# EAGLE design WS2801_MOSFET_Demo (EAGLE 6.5.0)
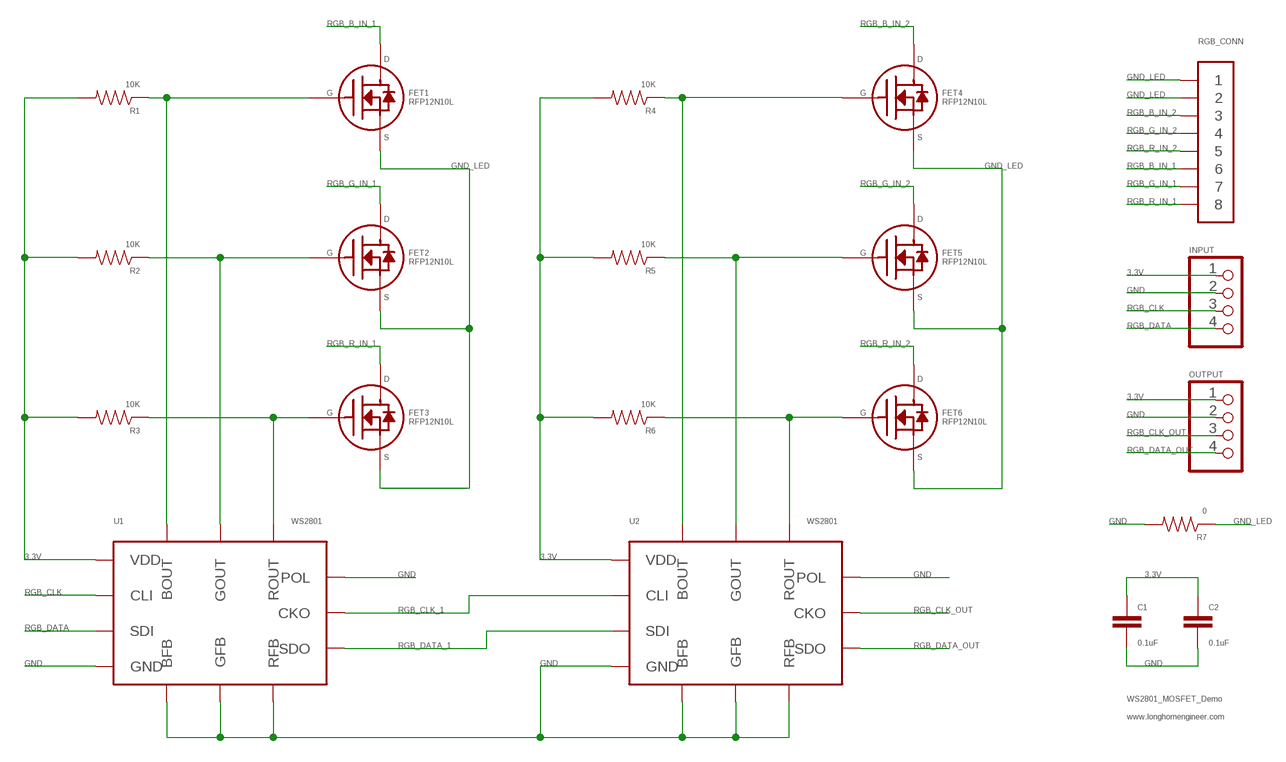
[diagram p0: schematic, sheet 1]

## Parts
C1  0.1uF  CAPACITOR_NON_POLAR0402  [0402]
C2  0.1uF  CAPACITOR_NON_POLAR0402  [0402]
FET1  RFP12N10L  MOSFET_N-CHANNEL_SINGLETO-220AB  [TO-220AB]
FET2  RFP12N10L  MOSFET_N-CHANNEL_SINGLETO-220AB  [TO-220AB]
FET3  RFP12N10L  MOSFET_N-CHANNEL_SINGLETO-220AB  [TO-220AB]
FET4  RFP12N10L  MOSFET_N-CHANNEL_SINGLETO-220AB  [TO-220AB]
FET5  RFP12N10L  MOSFET_N-CHANNEL_SINGLETO-220AB  [TO-220AB]
FET6  RFP12N10L  MOSFET_N-CHANNEL_SINGLETO-220AB  [TO-220AB]
INPUT  PH_1X04HEADER_PTH_ROUND  [HEADER_01X04_PTH_ROUND]
OUTPUT  PH_1X04HEADER_PTH_ROUND  [HEADER_01X04_PTH_ROUND]
R1  10K  RESISTOR0805  [0805]
R2  10K  RESISTOR0805  [0805]
R3  10K  RESISTOR0805  [0805]
R4  10K  RESISTOR0805  [0805]
R5  10K  RESISTOR0805  [0805]
R6  10K  RESISTOR0805  [0805]
R7  0  RESISTOR0402  [0402]
RGB_CONN  26-60-4080  PH_1X08PTH_ROUND  [HEADER_01X08_PTH_ROUND]
U1  WS2801  WS2801SOP-14  [SOP-14]
U2  WS2801  WS2801SOP-14  [SOP-14]

## Nets
3.3V: C1.1 C2.1 INPUT.1 OUTPUT.1 R1.2 R2.2 R3.2 R4.2 R5.2 R6.2 U1.14(VDD) U2.14(VDD)
GATE_B_IN_1: FET1.G(GATE) R1.1 U1.8(BOUT)
GATE_B_IN_2: FET4.G(GATE) R4.1 U2.8(BOUT)
GATE_G_IN_1: FET2.G(GATE) R2.1 U1.9(GOUT)
GATE_G_IN_2: FET5.G(GATE) R5.1 U2.9(GOUT)
GATE_R_IN_1: FET3.G(GATE) R3.1 U1.10(ROUT)
GATE_R_IN_2: FET6.G(GATE) R6.1 U2.10(ROUT)
GND: C1.2 C2.2 INPUT.2 OUTPUT.2 R7.2 U1.3(POL) U1.4(RFB) U1.5(GFB) U1.6(BFB) U1.7(GND) U2.3(POL) U2.4(RFB) U2.5(GFB) U2.6(BFB) U2.7(GND)
GND_LED: FET1.S(SOURCE) FET2.S(SOURCE) FET3.S(SOURCE) FET4.S(SOURCE) FET5.S(SOURCE) FET6.S(SOURCE) R7.1 RGB_CONN.1 RGB_CONN.2
RGB_B_IN_1: FET1.D(DRAIN) RGB_CONN.6
RGB_B_IN_2: FET4.D(DRAIN) RGB_CONN.3
RGB_CLK: INPUT.3 U1.1(CLI)
RGB_CLK_1: U1.13(CKO) U2.1(CLI)
RGB_CLK_OUT: OUTPUT.3 U2.13(CKO)
RGB_DATA: INPUT.4 U1.2(SDI)
RGB_DATA_1: U1.12(SDO) U2.2(SDI)
RGB_DATA_OUT: OUTPUT.4 U2.12(SDO)
RGB_G_IN_1: FET2.D(DRAIN) RGB_CONN.7
RGB_G_IN_2: FET5.D(DRAIN) RGB_CONN.4
RGB_R_IN_1: FET3.D(DRAIN) RGB_CONN.8
RGB_R_IN_2: FET6.D(DRAIN) RGB_CONN.5

## Notes on the sheet
- WS2801_MOSFET_Demo
- www.longhornengineer.com

## Library data of the parts
C1 C2 = PP_Passives:CAPACITOR_NON_POLAR: Capacitor Non Polarized
FET1-FET6 = PP_DiscreteSemi:MOSFET_N-CHANNEL_SINGLE: Mosfet - N-Channel - Single
INPUT OUTPUT = PP_Connectors:PH_1X04: 4 Pin Connectors
R1-R7 = PP_Passives:RESISTOR: Resistors
RGB_CONN = PP_Connectors:PH_1X08
U1 U2 = PP_DigitalIC:WS2801

## Net classes
0 default: width 0.178 mm, drill 0.5 mm, clearance 0.178 mm

## Board
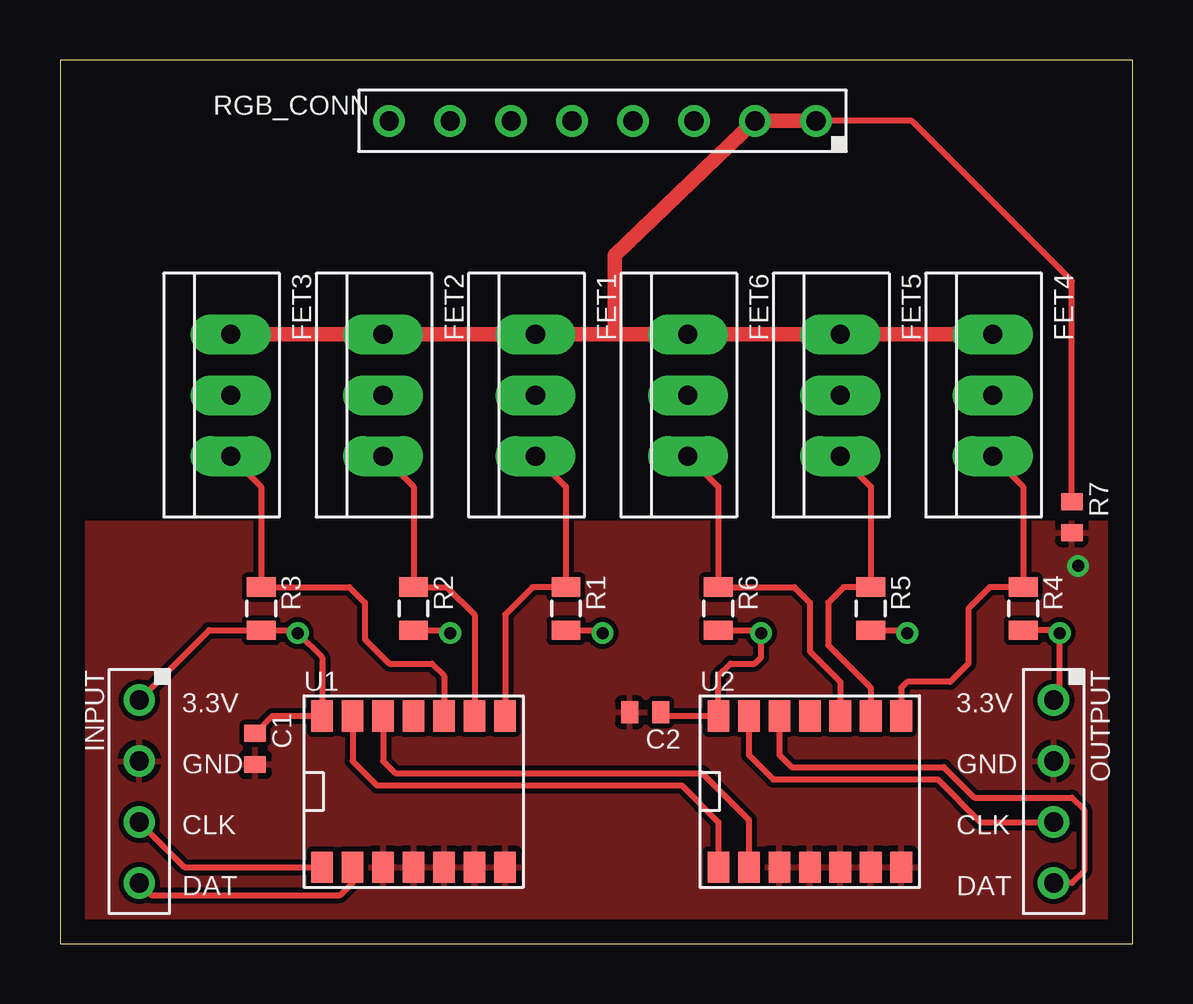
[diagram p1: board, top side]
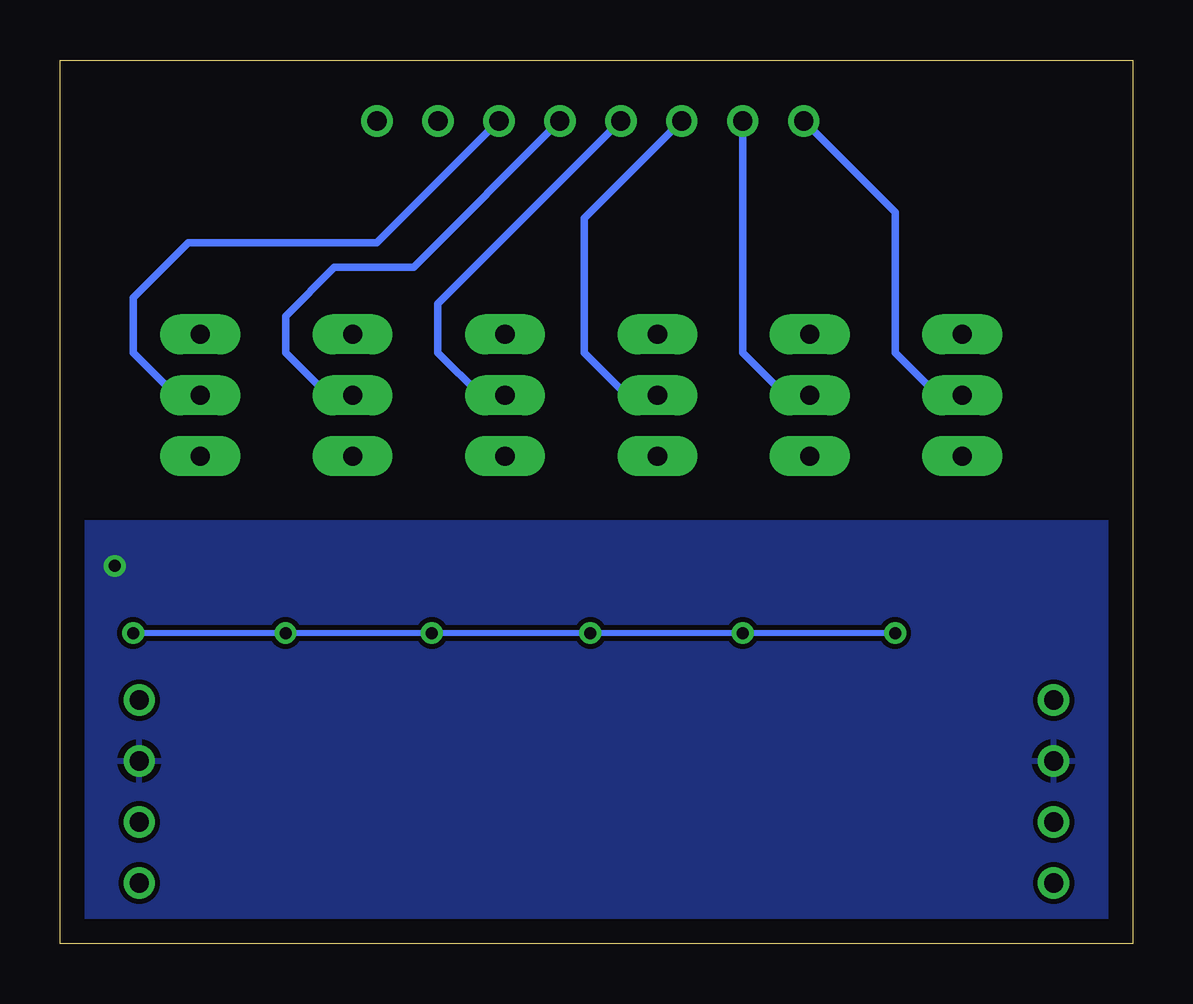
[diagram p2: board, bottom side, seen from below]

Size 44.7 x 36.83 mm. Coordinates in mm from the lower left corner, seen from the top.
Outline: 0,36.83 0,0 44.7,0 44.7,36.83 0,36.83
Copper layers (1*16): Top 0.035mm / dielectric 1.5mm / Bottom 0.035mm
Design rules "default": minimum track width 10mil, minimum drill 0.6mm, track to track 8mil, track to pad 8mil, pad to pad 8mil, via to via 8mil, smd to smd 8mil, copper to edge 40mil, drill to drill 8mil, minimum pad ring 10mil, minimum via ring 8mil, stop-mask expansion 4mil, vias tented up to drill 0mil, thermal gap 10mil

### Footprints (pad centres in the part's own frame; a part is rotated, then mirrored left to right if it is on the bottom)
0402 = smd 0.7 x 0.9: 1 -0.65,0; 2 0.65,0
TO-220AB = drill 0.8 pad 1.676 long: D 0,0; G 2.54,0; S -2.54,0
HEADER_01X04_PTH_ROUND = drill 0.8: 1 -3.81,0; 2 -1.27,0; 3 1.27,0; 4 3.81,0
0805 = smd 0.8 x 1.2: 1 -0.9,0; 2 0.9,0
HEADER_01X08_PTH_ROUND = drill 0.8: 1 -8.89,0; 2 -6.35,0; 3 -3.81,0; 4 -1.27,0; 5 1.27,0; 6 3.81,0; 7 6.35,0; 8 8.89,0
SOP-14 = smd 0.9 x 1.3: 1 -3.81,-3.15; 2 -2.54,-3.15; 3 -1.27,-3.15; 4 0,-3.15; 5 1.27,-3.15; 6 2.54,-3.15; 7 3.81,-3.15; 8 3.81,3.15; 9 2.54,3.15; 10 1.27,3.15; 11 0,3.15; 12 -1.27,3.15; 13 -2.54,3.15; 14 -3.81,3.15

### Placement (x,y rotation side)
C1  8.13,8.13 270 top
C2  24.38,9.65 180 top
FET1  19.81,22.86 270 top
FET2  13.46,22.86 270 top
FET3  7.11,22.86 270 top
FET4  38.86,22.86 270 top
FET5  32.51,22.86 270 top
FET6  26.16,22.86 270 top
INPUT  3.3,6.35 270 top
OUTPUT  41.4,6.35 270 top
R1  21.08,13.97 270 top
R2  14.73,13.97 270 top
R3  8.38,13.97 270 top
R4  40.13,13.97 270 top
R5  33.78,13.97 270 top
R6  27.43,13.97 270 top
R7  42.16,17.78 270 top
RGB_CONN  22.61,34.29 180 top
U1  14.73,6.35 0 top
U2  31.24,6.35 0 top

### Tracks (layer width: path | path; a pad name or v marks a point on that pad's centre or on a via)
3.3V  (via drill 0.5)
  Top 0.254: R4.2 41.54,13.07 v41.66,12.95 41.66,10.41 OUTPUT.1 | R5.2 35.19,13.07 v35.31,12.95 | R6.2 29.09,13.07 v29.21,12.95 29.21,11.94 28.96,11.68 27.94,11.68 27.43,11.18 U2.14 25.19,9.5 C2.1 | R1.2 22.49,13.07 v22.61,12.95 | R2.2 16.14,13.07 v16.26,12.95 | INPUT.1 6.21,13.07 R3.2 9.79,13.07 v9.91,12.95 10.92,11.94 U1.14 8.85,9.5 C1.1
  Bottom 0.254: v9.91,12.95 v16.26,12.95 v22.61,12.95 v29.21,12.95 v35.31,12.95 v41.66,12.95
GATE_B_IN_1
  Top 0.254: FET1.G 21.08,19.05 R1.1 19.7,14.87 18.54,13.72 U1.8
GATE_B_IN_2
  Top 0.254: FET4.G 40.13,19.05 R4.1 38.75,14.87 37.85,13.97 37.85,11.68 37.08,10.92 35.31,10.92 35.05,10.67 U2.8
GATE_G_IN_1
  Top 0.254: FET2.G 14.73,19.05 R2.1 16.12,14.87 17.27,13.72 U1.9
GATE_G_IN_2
  Top 0.254: FET5.G 33.78,19.05 R5.1 32.65,14.87 32,14.22 32,12.45 33.78,10.67 U2.9
GATE_R_IN_1
  Top 0.254: FET3.G 8.38,19.05 R3.1 12.05,14.87 12.7,14.22 12.7,12.7 13.72,11.68 15.49,11.68 16,11.18 U1.10
GATE_R_IN_2
  Top 0.254: FET6.G 27.43,19.05 R6.1 30.6,14.87 31.24,14.22 31.24,12.19 32.51,10.92 U2.10
GND  (via drill 0.5)
  other vias: 42.42,15.75
  pour Top: 0,17.53 44.7,17.53 44.7,0.25 0,0.25
  pour Bottom: 0,17.53 44.7,17.53 44.7,0.25 0,0.25
GND_LED
  Top 0.254: R7.1 42.16,27.62 35.5,34.29 RGB_CONN.1
  Top 0.61: FET3.S FET2.S FET1.S 23.11,25.4 | 23.11,25.4 FET6.S FET5.S FET4.S | 23.11,25.4 23.11,28.7 RGB_CONN.2 RGB_CONN.1
RGB_B_IN_1
  Bottom 0.305: RGB_CONN.6 22.86,30.23 22.86,24.64 21.08,22.86 FET1.D
RGB_B_IN_2
  Bottom 0.305: RGB_CONN.3 31.5,29.21 39.37,29.21 41.66,26.92 41.66,24.64 39.88,22.86 FET4.D
RGB_CLK
  Top 0.254: INPUT.3 5.18,3.2 U1.1
RGB_CLK_1
  Top 0.254: U1.13 12.19,7.62 13.21,6.6 25.91,6.6 27.43,5.08 U2.1
RGB_CLK_OUT
  Top 0.254: U2.13 28.7,7.87 29.72,6.86 36.58,6.86 38.35,5.08 OUTPUT.3
RGB_DATA
  Top 0.254: INPUT.4 3.81,2.03 11.68,2.03 12.19,2.54 U1.2
RGB_DATA_1
  Top 0.254: U2.2 28.7,5.17 26.76,7.11 13.97,7.11 13.46,7.62 U1.12
RGB_DATA_OUT
  Top 0.254: U2.12 29.97,7.87 30.48,7.37 36.83,7.37 38.1,6.1 42.16,6.1 42.67,5.59 42.67,3.05 42.16,2.54 OUTPUT.4
RGB_G_IN_1
  Bottom 0.305: RGB_CONN.7 16.26,24.64 14.48,22.86 FET2.D
RGB_G_IN_2
  Bottom 0.305: RGB_CONN.4 29.97,28.19 33.27,28.19 35.31,26.16 35.31,24.64 33.53,22.86 FET5.D
RGB_R_IN_1
  Bottom 0.305: RGB_CONN.8 9.91,30.48 9.91,24.64 8.13,22.86 FET3.D
RGB_R_IN_2
  Bottom 0.305: RGB_CONN.5 28.96,26.67 28.96,24.64 27.18,22.86 FET6.D

### Text on the board
tPlace: 3.3V | 3.3V | GND | GND | CLK | CLK | DAT | DAT